# EAGLE schematic 4Bit Computer - 4 Bit Adder - 74S283N (EAGLE 7.6.0)
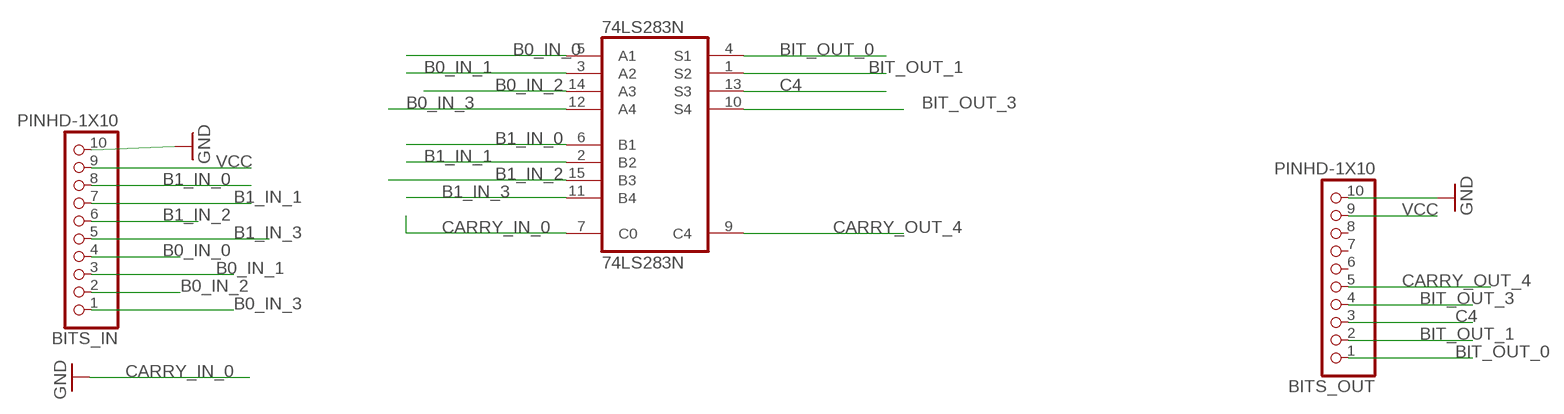
[diagram p0: schematic, sheet 1]

## Parts
74LS283N  74LS283N  [DIL16]
BITS_IN  PINHD-1X10  [1X10-BIG]
BITS_OUT  PINHD-1X10  [1X10-BIG]

## Nets
B0_IN_0: 74LS283N.5(A1) BITS_IN.4
B0_IN_1: 74LS283N.3(A2) BITS_IN.3
B0_IN_2: 74LS283N.14(A3) BITS_IN.2
B0_IN_3: 74LS283N.12(A4) BITS_IN.1
B1_IN_0: 74LS283N.6(B1) BITS_IN.8
B1_IN_1: 74LS283N.2(B2) BITS_IN.7
B1_IN_2: 74LS283N.15(B3) BITS_IN.6
B1_IN_3: 74LS283N.11(B4) BITS_IN.5
BIT_OUT_0: 74LS283N.4(S1) BITS_OUT.1
BIT_OUT_1: 74LS283N.1(S2) BITS_OUT.2
BIT_OUT_3: 74LS283N.10(S4) BITS_OUT.4
C4: 74LS283N.13(S3) BITS_OUT.3
CARRY_IN_0: 74LS283N.7(C0) ; supply symbol labelled GND
CARRY_OUT_4: 74LS283N.9(C4) BITS_OUT.5
GND: BITS_IN.10 BITS_OUT.10
VCC: BITS_IN.9 BITS_OUT.9
Unconnected: BITS_OUT.6 BITS_OUT.7 BITS_OUT.8

## Power pins joined to a net without a drawn wire
GND: 74LS283N.8(GND)
VCC: 74LS283N.16(VCC)

## Library data of the parts
74LS283N = 74xx-eu:74*283: 4-bit binary FULL ADDER, fast carry
BITS_IN BITS_OUT = adafruit:PINHD-1X10: Pin header 1x10 0.1" spacing With round pins